# EAGLE design R201X (EAGLE 6.6.0)
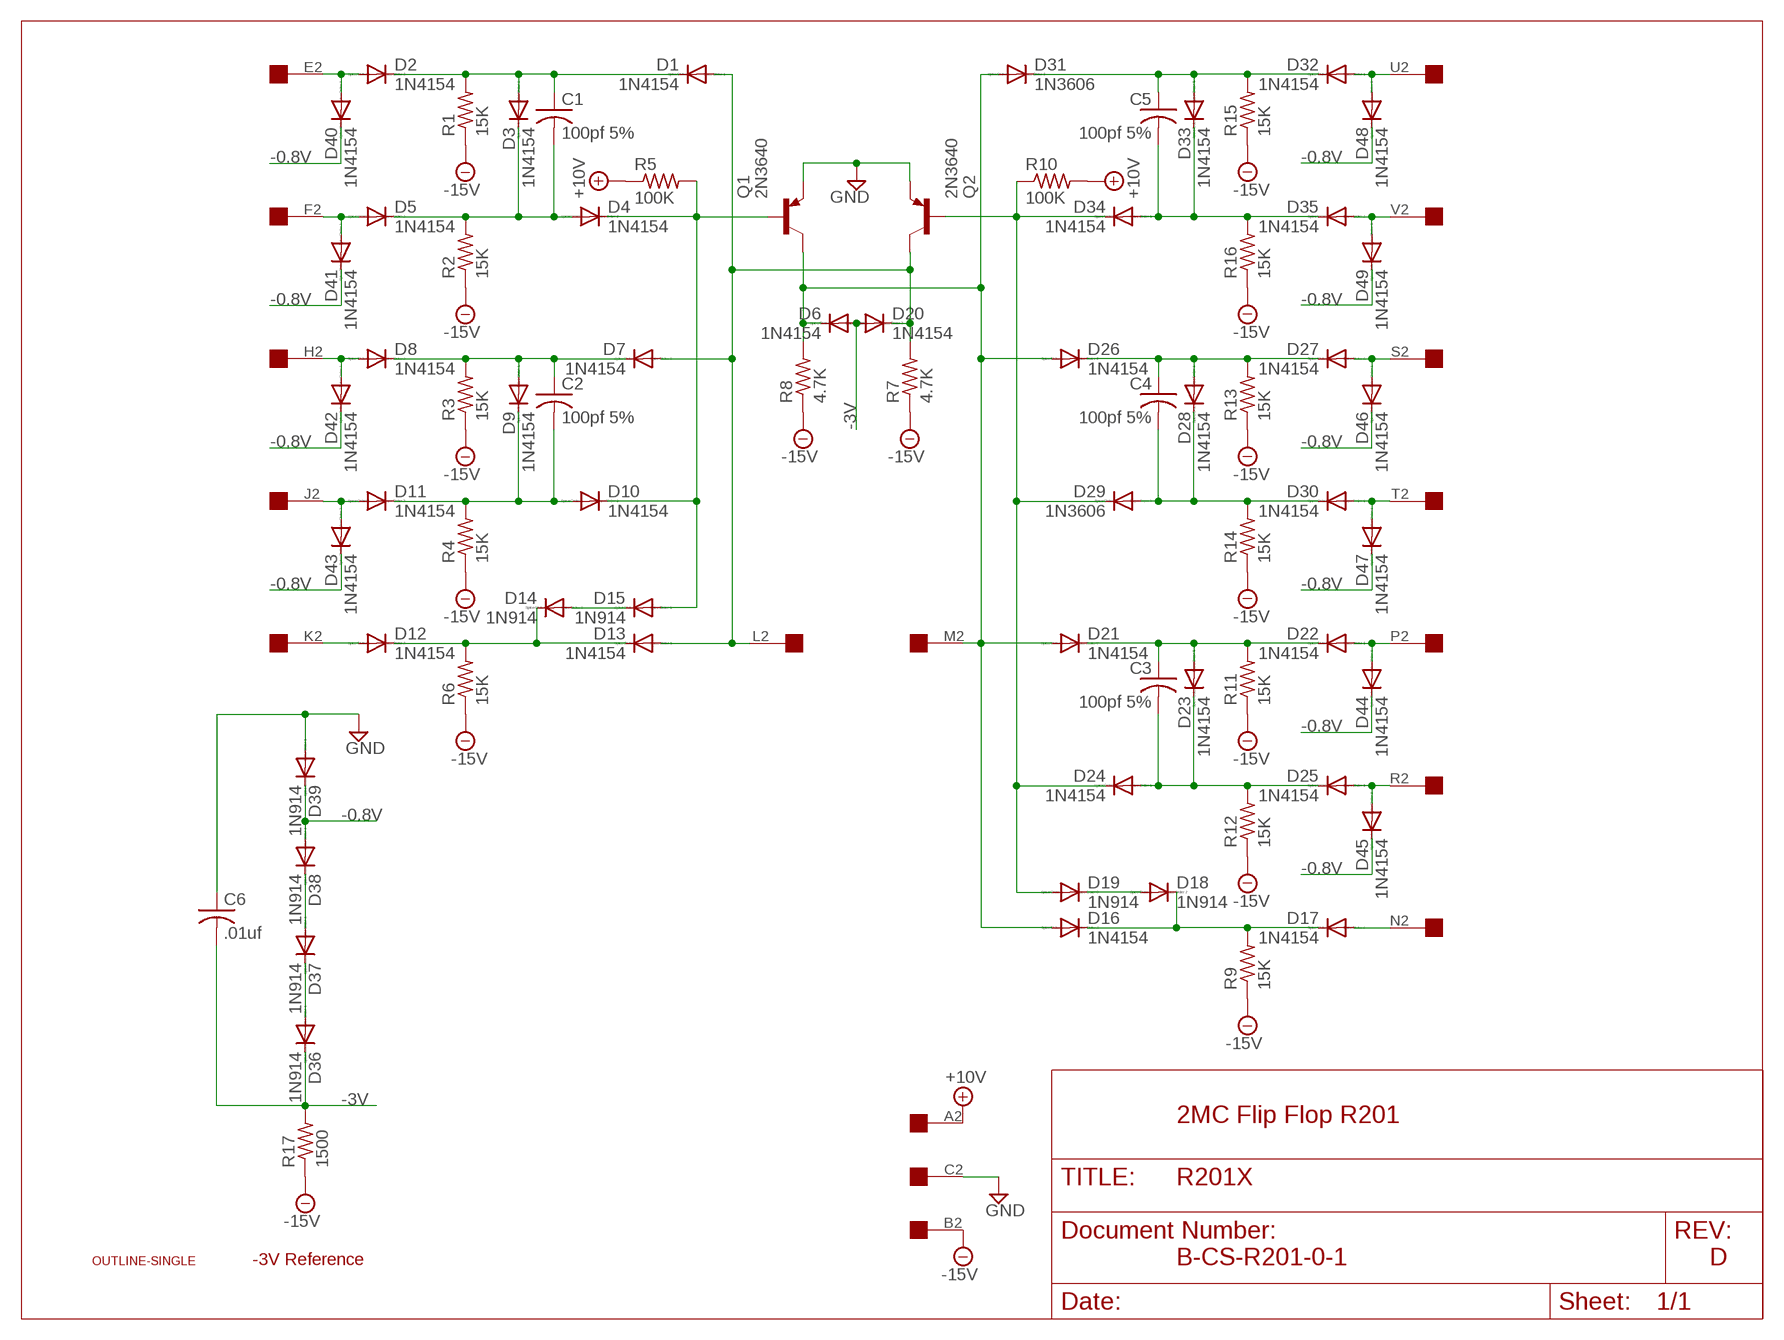
[diagram p0: schematic, sheet 1]

## Parts
C1  100pf 5%  C-US050-025X075  [C050-025X075]
C2  100pf 5%  C-US050-025X075  [C050-025X075]
C3  100pf 5%  C-US050-025X075  [C050-025X075]
C4  100pf 5%  C-US050-025X075  [C050-025X075]
C5  100pf 5%  C-US050-025X075  [C050-025X075]
C6  .01uf  C-US050-025X075  [C050-025X075]
D1  1N4154  1N4148DO35-10  [DO35-10]
D2  1N4154  1N4148DO35-10  [DO35-10]
D3  1N4154  1N4148DO35-10  [DO35-10]
D4  1N4154  1N4148DO35-10  [DO35-10]
D5  1N4154  1N4148DO35-10  [DO35-10]
D6  1N4154  1N4148DO35-10  [DO35-10]
D7  1N4154  1N4148DO35-10  [DO35-10]
D8  1N4154  1N4148DO35-10  [DO35-10]
D9  1N4154  1N4148DO35-10  [DO35-10]
D10  1N4154  1N4148DO35-10  [DO35-10]
D11  1N4154  1N4148DO35-10  [DO35-10]
D12  1N4154  1N4148DO35-10  [DO35-10]
D13  1N4154  1N4148DO35-10  [DO35-10]
D14  1N914  1N4148DO35-10  [DO35-10]
D15  1N914  1N4148DO35-10  [DO35-10]
D16  1N4154  1N4148DO35-10  [DO35-10]
D17  1N4154  1N4148DO35-10  [DO35-10]
D18  1N914  1N4148DO35-10  [DO35-10]
D19  1N914  1N4148DO35-10  [DO35-10]
D20  1N4154  1N4148DO35-10  [DO35-10]
D21  1N4154  1N4148DO35-10  [DO35-10]
D22  1N4154  1N4148DO35-10  [DO35-10]
D23  1N4154  1N4148DO35-10  [DO35-10]
D24  1N4154  1N4148DO35-10  [DO35-10]
D25  1N4154  1N4148DO35-10  [DO35-10]
D26  1N4154  1N4148DO35-10  [DO35-10]
D27  1N4154  1N4148DO35-10  [DO35-10]
D28  1N4154  1N4148DO35-10  [DO35-10]
D29  1N3606  1N4148DO35-10  [DO35-10]
D30  1N4154  1N4148DO35-10  [DO35-10]
D31  1N3606  1N4148DO35-10  [DO35-10]
D32  1N4154  1N4148DO35-10  [DO35-10]
D33  1N4154  1N4148DO35-10  [DO35-10]
D34  1N4154  1N4148DO35-10  [DO35-10]
D35  1N4154  1N4148DO35-10  [DO35-10]
D36  1N914  1N4148DO35-10  [DO35-10]
D37  1N914  1N4148DO35-10  [DO35-10]
D38  1N914  1N4148DO35-10  [DO35-10]
D39  1N914  1N4148DO35-10  [DO35-10]
D40  1N4154  1N4148DO35-10  [DO35-10]
D41  1N4154  1N4148DO35-10  [DO35-10]
D42  1N4154  1N4148DO35-10  [DO35-10]
D43  1N4154  1N4148DO35-10  [DO35-10]
D44  1N4154  1N4148DO35-10  [DO35-10]
D45  1N4154  1N4148DO35-10  [DO35-10]
D46  1N4154  1N4148DO35-10  [DO35-10]
D47  1N4154  1N4148DO35-10  [DO35-10]
D48  1N4154  1N4148DO35-10  [DO35-10]
D49  1N4154  1N4148DO35-10  [DO35-10]
Q1  2N3640  2N3637  [TO39]
Q2  2N3640  2N3637  [TO39]
R1  15K  R-US_0207/10  [0207/10]
R2  15K  R-US_0207/10  [0207/10]
R3  15K  R-US_0207/10  [0207/10]
R4  15K  R-US_0207/10  [0207/10]
R5  100K  R-US_0207/10  [0207/10]
R6  15K  R-US_0207/10  [0207/10]
R7  4.7K  R-US_0207/10  [0207/10]
R8  4.7K  R-US_0207/10  [0207/10]
R9  15K  R-US_0207/10  [0207/10]
R10  100K  R-US_0207/10  [0207/10]
R11  15K  R-US_0207/10  [0207/10]
R12  15K  R-US_0207/10  [0207/10]
R13  15K  R-US_0207/10  [0207/10]
R14  15K  R-US_0207/10  [0207/10]
R15  15K  R-US_0207/10  [0207/10]
R16  15K  R-US_0207/10  [0207/10]
R17  1500  R-US_0207/10  [0207/10]
U$1  OUTLINE-SINGLE  [SINGLE]
U$2  EDGE-1  [EDGE-CON1]

## Nets
+10V [Power]: R5.1 R10.2 U$2.A2
-0.8V [Power]: D38.A D39.C D40.C D41.C D42.C D43.C D44.C D45.C D46.C D47.C D48.C D49.C
-3V [Power]: C6.2 D6.A D20.A D36.C R17.2
-15V [Power]: R1.1 R2.1 R3.1 R4.1 R6.1 R7.1 R8.1 R9.1 R11.1 R12.1 R13.1 R14.1 R15.1 R16.1 R17.1 U$2.B2
GND [Power]: C6.1 D39.A Q1.1(E) Q2.1(E) U$2.C2
L: D1.A D7.A D13.A D20.C Q2.3(C) R7.2 U$2.L2
M: D6.C D16.A D21.A D26.A D31.A Q1.3(C) R8.2 U$2.M2
N$1: D5.A D41.A U$2.F2
N$2: C5.1 D31.C D32.C D33.A R15.2
N$3: C1.2 D3.C D4.A D5.C R2.2
N$4: C1.1 D1.C D2.C D3.A R1.2
N$5: D12.A U$2.K2
N$6: D19.A D24.C D29.C D34.C Q2.2(B) R10.1
N$7: D32.A D48.A U$2.U2
N$8: C5.2 D33.C D34.A D35.C R16.2
N$9: D17.A U$2.N2
N$10: D2.A D40.A U$2.E2
N$11: D35.A D49.A U$2.V2
N$12: D18.A D19.C
N$13: D37.A D38.C
N$14: D4.C D10.C D15.A Q1.2(B) R5.2
N$15: D14.A D15.C
N$16: D36.A D37.C
N$17: D22.A D44.A U$2.P2
N$18: D12.C D13.C D14.C R6.2
N$19: D8.A D42.A U$2.H2
N$20: D16.C D17.C D18.C R9.2
N$21: D11.A D43.A U$2.J2
N$22: C2.2 D9.C D10.A D11.C R4.2
N$23: D27.A D46.A U$2.S2
N$24: C2.1 D7.C D8.C D9.A R3.2
N$25: D30.A D47.A U$2.T2
N$26: C4.2 D28.C D29.A D30.C R14.2
N$27: C4.1 D26.C D27.C D28.A R13.2
N$28: D25.A D45.A U$2.R2
N$29: C3.2 D23.C D24.A D25.C R12.2
N$30: C3.1 D21.C D22.C D23.A R11.2
Unconnected: U$2.D2

## Notes on the sheet
- 2MC Flip Flop R201
- -3V Reference | B-CS-R201-0-1 | D

## Library data of the parts
C1-C6 = rcl:C-US: CAPACITOR, American symbol
D1-D49 = diode:1N4148: DIODE high speed (Philips)
Q1 Q2 = transistor-pnp:2N3637*: PNP Transistror
R1-R17 = rcl:R-US_: RESISTOR, American symbol
U$1 = dec-con:OUTLINE-*: Board outlines for DEC boards.
U$2 = dec-con:EDGE-1: Single-Sided DEC Edge Connector -- (side 2)

## Net classes
1 Power: width 0.813 mm

## Board
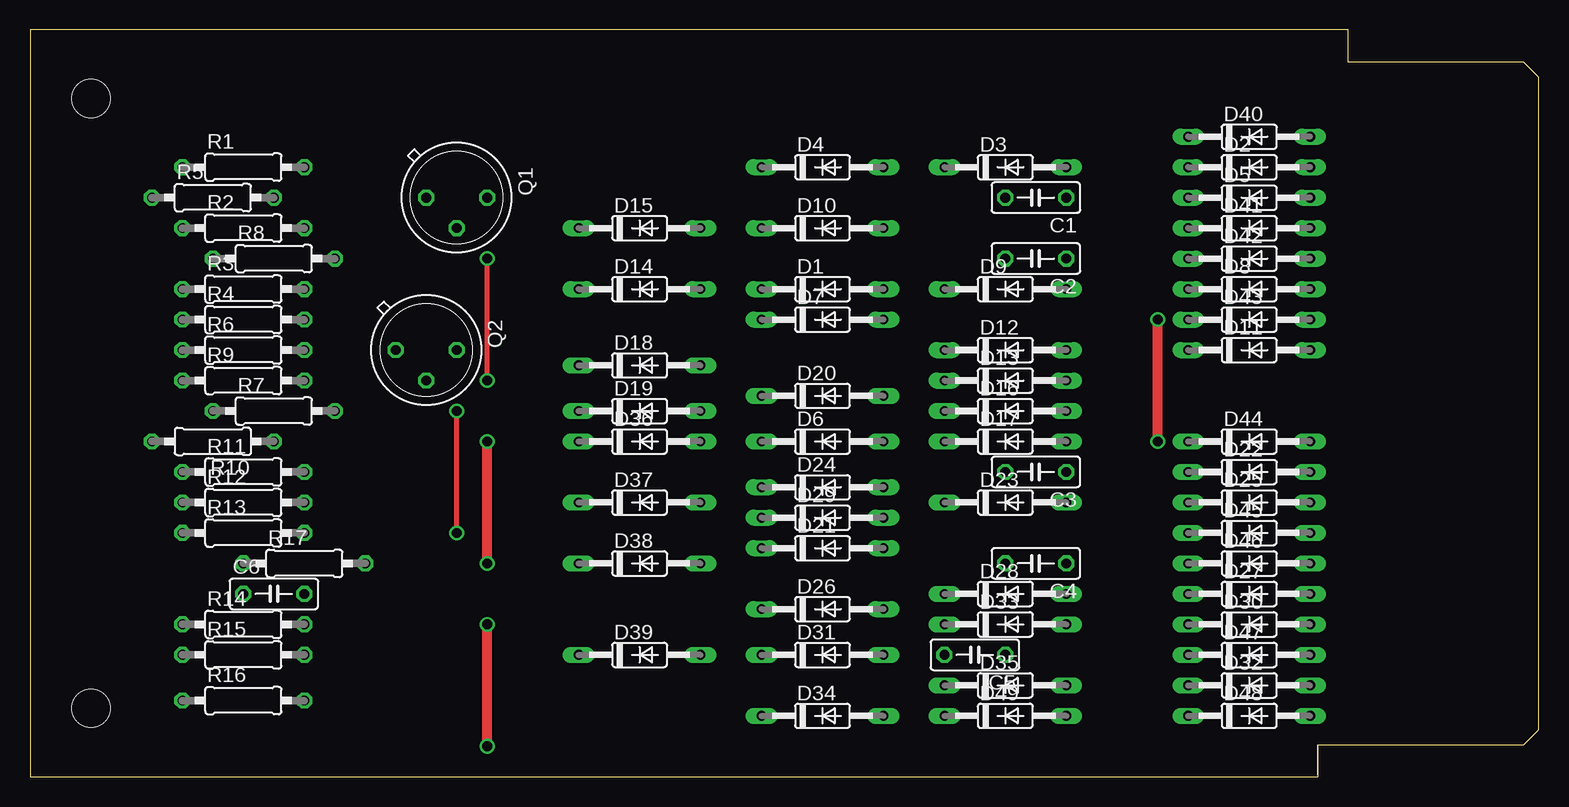
[diagram p1: board, top side]
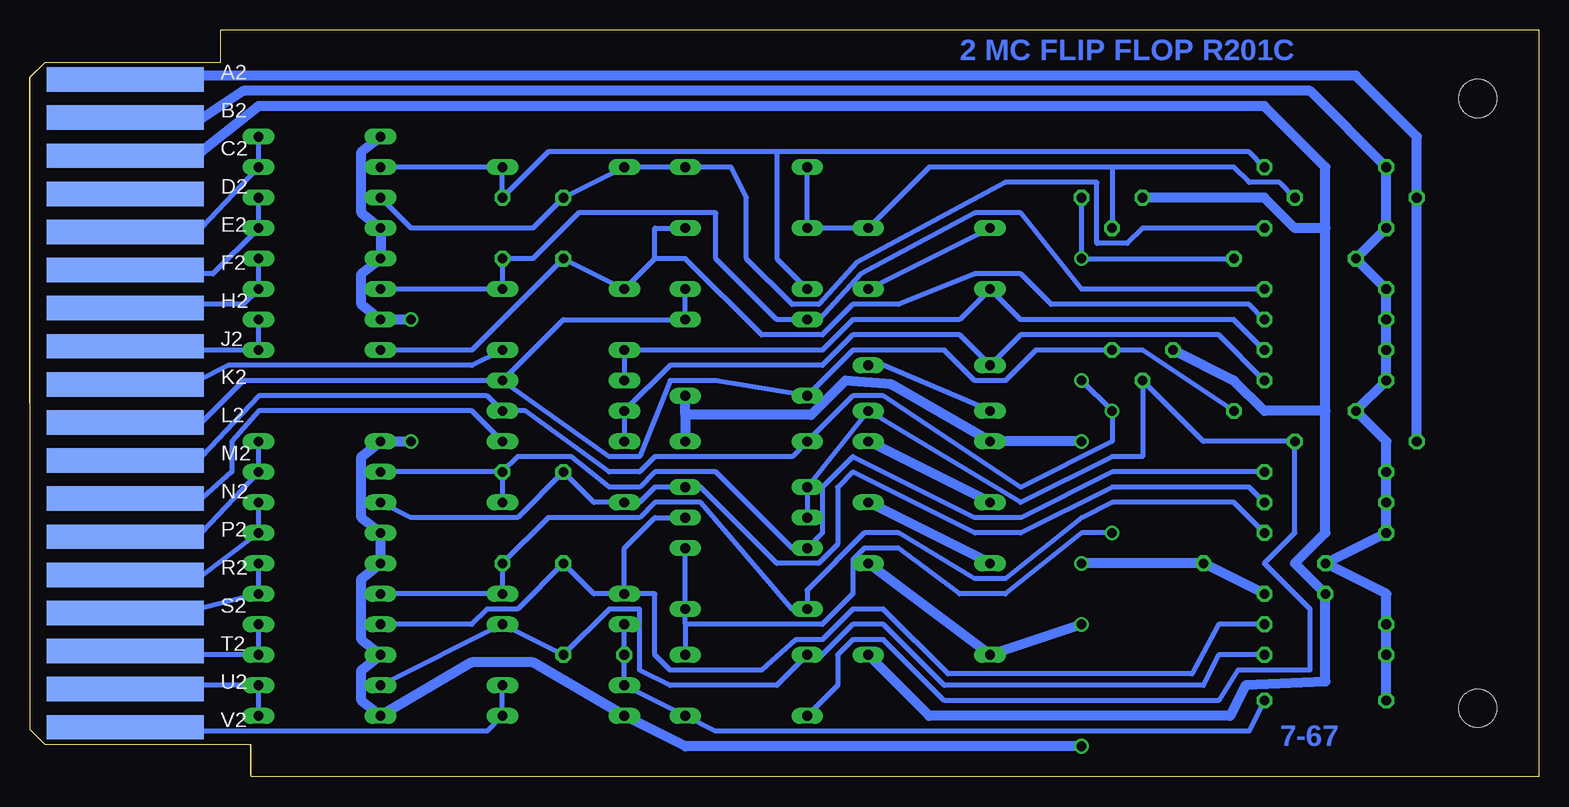
[diagram p2: board, bottom side, seen from below]

Size 125.73 x 62.23 mm. Coordinates in mm from the lower left corner, seen from the top.
Copper layers (1+16): Top 0.035mm / dielectric 1.5mm / Bottom 0.035mm
Design rules "16mils": minimum track width 16mil, minimum drill 32mil, track to track 15mil, track to pad 10mil, pad to pad 10mil, via to via 10mil, smd to smd 10mil, copper to edge 13mil, drill to drill 10mil, minimum pad ring 10mil, minimum via ring 8mil, stop-mask expansion 0mil, vias tented up to drill 0mil, thermal gap 10mil

### Footprints (pad centres in the part's own frame; a part is rotated, then mirrored left to right if it is on the bottom)
C050-025X075 = drill 0.813 octagon: 1 -2.54,0; 2 2.54,0
DO35-10 = drill 0.813 long: A 5.08,0; C -5.08,0
TO39 = drill 0.813 octagon: 1 0,-2.54; 2 2.54,0; 3 0,2.54
0207/10 = drill 0.813 octagon: 1 -5.08,0; 2 5.08,0
SINGLE = hole 3.175: 120.65,56.515; 120.65,5.715
EDGE-CON1 = smd 13.106 x 2.032 bottom: A2 7.938,4.128; B2 7.938,7.303; C2 7.938,10.477; D2 7.938,13.652; E2 7.938,16.828; F2 7.938,20.003; H2 7.938,23.177; J2 7.938,26.352; K2 7.938,29.527; L2 7.938,32.703; M2 7.938,35.877; N2 7.938,39.053; P2 7.938,42.227; R2 7.938,45.403; S2 7.938,48.578; T2 7.938,51.752; U2 7.938,54.928; V2 7.938,58.102

### Placement (x,y rotation side)
C1  83.82,48.26 180 top
C2  83.82,43.18 180 top
C3  83.82,25.4 180 top
C4  83.82,17.78 180 top
C5  78.74,10.16 180 top
C6  20.32,15.24 0 top
D1  66.04,40.64 0 top
D2  101.6,50.8 0 top
D3  81.28,50.8 0 top
D4  66.04,50.8 0 top
D5  101.6,48.26 0 top
D6  66.04,27.94 0 top
D7  66.04,38.1 0 top
D8  101.6,40.64 0 top
D9  81.28,40.64 0 top
D10  66.04,45.72 0 top
D11  101.6,35.56 0 top
D12  81.28,35.56 0 top
D13  81.28,33.02 0 top
D14  50.8,40.64 0 top
D15  50.8,45.72 0 top
D16  81.28,30.48 0 top
D17  81.28,27.94 0 top
D18  50.8,34.29 0 top
D19  50.8,30.48 0 top
D20  66.04,31.75 0 top
D21  66.04,19.05 0 top
D22  101.6,25.4 0 top
D23  81.28,22.86 0 top
D24  66.04,24.13 0 top
D25  101.6,22.86 0 top
D26  66.04,13.97 0 top
D27  101.6,15.24 0 top
D28  81.28,15.24 0 top
D29  66.04,21.59 0 top
D30  101.6,12.7 0 top
D31  66.04,10.16 0 top
D32  101.6,7.62 0 top
D33  81.28,12.7 0 top
D34  66.04,5.08 0 top
D35  81.28,7.62 0 top
D36  50.8,27.94 0 top
D37  50.8,22.86 0 top
D38  50.8,17.78 0 top
D39  50.8,10.16 0 top
D40  101.6,53.34 0 top
D41  101.6,45.72 0 top
D42  101.6,43.18 0 top
D43  101.6,38.1 0 top
D44  101.6,27.94 0 top
D45  101.6,20.32 0 top
D46  101.6,17.78 0 top
D47  101.6,10.16 0 top
D48  101.6,5.08 0 top
D49  81.28,5.08 0 top
Q1  35.56,48.26 270 top
Q2  33.02,35.56 270 top
R1  17.78,50.8 0 top
R2  17.78,45.72 0 top
R3  17.78,40.64 0 top
R4  17.78,38.1 0 top
R5  15.24,48.26 0 top
R6  17.78,35.56 0 top
R7  20.32,30.48 0 top
R8  20.32,43.18 0 top
R9  17.78,33.02 0 top
R10  15.24,27.94 180 top
R11  17.78,25.4 0 top
R12  17.78,22.86 0 top
R13  17.78,20.32 0 top
R14  17.78,12.7 0 top
R15  17.78,10.16 0 top
R16  17.78,6.35 0 top
R17  22.86,17.78 0 top
U$1  125.73,62.23 180 top
U$2  125.73,62.23 180 top

### Tracks (layer width: path | path; a pad name or v marks a point on that pad's centre or on a via)
+10V
  Bottom 0.813: R10.2 R5.1 10.16,53.34 15.24,58.42 111.76,58.42 U$2.A2
-0.8V  (via drill 0.81)
  Top 0.813: v93.98,27.94 v93.98,38.1 | v38.1,2.54 v38.1,12.7
  Bottom 0.813: D40.C 98.11,52.07 98.11,46.99 D41.C D42.C 98.11,41.91 98.11,39.37 D43.C v93.98,38.1 | v93.98,27.94 D44.C 98.11,26.67 98.11,21.59 D45.C D46.C 98.11,16.51 98.11,11.43 D47.C 98.11,8.89 98.11,6.35 D48.C 88.9,9.53 83.82,9.53 D49.C 71.12,2.54 v38.1,2.54 | v38.1,12.7 D39.C D38.A
-3V  (via drill 0.81)
  Top 0.813: v38.1,17.78 v38.1,27.94
  Bottom 0.813: v38.1,27.94 D36.C 53.98,32.7 57.78,33.02 60.64,30.16 71.12,30.16 | v38.1,17.78 R17.2 C6.2 | 71.12,30.16 D6.A | 71.12,30.16 D20.A
-15V
  Bottom 0.813: R16.1 R15.1 R14.1 12.7,15.24 R17.1 R13.1 R12.1 R11.1 12.7,27.94 R7.1 R9.1 R6.1 R4.1 R3.1 R8.1 R2.1 R1.1 19.05,57.15 107.95,57.15 111.76,54.61 U$2.B2
GND
  Bottom 0.813: U$2.C2 111.44,52.07 106.68,55.88 22.86,55.88 17.78,50.8 17.78,45.72 | 17.78,30.48 17.78,20.32 20.32,17.78 C6.1 17.78,7.94 24.45,7.62 25.72,5.08 50.8,5.08 D39.A | 17.78,30.48 17.78,45.72 | Q1.1 22.86,48.26 20.32,45.72 17.78,45.72 | Q2.1 25.4,33.02 22.86,30.48 17.78,30.48
L
  Bottom 0.406: U$2.L2 111.76,29.21 107.95,33.02 D13.A | D1.A D7.A 81.28,38.1 D13.A | D13.A 77.47,26.67 74.93,26.67 72.39,33.02 68.58,33.02 D20.C 57.15,35.56 49.53,35.56 46.99,33.02 44.45,33.02 41.91,35.56 Q2.3 33.02,35.56 R7.2
M  (via drill 0.81)
  Top 0.406: v38.1,33.02 v38.1,43.18 | v35.56,20.32 v35.56,30.48
  Bottom 0.406: U$2.M2 111.44,26.67 106.68,31.75 87.63,31.75 D16.A 84.45,30.48 77.47,25.4 74.93,25.4 73.66,26.67 62.23,26.67 D6.C 57.15,31.75 54.61,31.75 43.18,24.13 35.56,27.94 v35.56,30.48 v38.1,33.02 | D21.A D26.A 71.12,12.7 | 71.12,12.7 D31.A | R8.2 v38.1,43.18 Q1.3 | 71.12,12.7 59.69,12.7 57.15,15.24 57.15,18.1 56.2,19.05 53.34,19.05 48.26,15.24 44.45,15.24 38.1,20.32 v35.56,20.32
N$1
  Bottom 0.406: U$2.F2 112.04,42.19 111.76,41.91 110.49,41.91 D41.A D5.A
N$2
  Bottom 0.406: D32.C D33.A C5.1 77.47,13.97 74.93,13.97 74.93,8.89 72.39,7.62 63.5,7.62 D31.C 59.69,10.16 57.15,12.7 54.61,12.7 49.53,7.62 27.94,7.62 26.67,10.16 R15.2
N$3
  Bottom 0.406: D5.C 93.98,45.72 83.82,45.72 C1.2 D3.C D4.A 67.31,50.8 66.04,48.26 66.04,43.18 62.23,39.37 60.01,39.37 56.83,42.86 44.45,49.53 36.83,49.53 36.83,44.45 34.29,44.45 33.02,45.72 R2.2
N$4
  Bottom 0.406: D2.C D3.A C1.1 82.55,52.07 63.5,52.07 | 63.5,52.07 63.5,43.18 D1.C | R1.2 24.13,52.07 63.5,52.07
N$5
  Bottom 0.406: U$2.K2 111.76,33.02 109.22,34.29 88.9,34.29 D12.A
N$6
  Bottom 0.406: D29.C D24.C D19.A 43.18,22.86 35.56,26.67 33.02,26.67 Q2.2 27.94,27.94 R10.1 20.32,20.32 22.86,17.78 19.05,13.97 19.05,8.89 25.08,8.89 26.67,6.35 49.53,6.35 54.61,11.43 57.15,11.43 58.42,10.16 58.42,7.62 D34.C
N$7
  Bottom 0.406: U$2.U2 111.76,7.62 D32.A D48.A
N$8
  Bottom 0.406: D33.C C5.2 D35.C D34.A 68.58,3.81 24.13,3.81 R16.2
N$9
  Bottom 0.406: U$2.N2 111.76,22.86 108.9,25.4 108.9,27.94 106.68,30.48 88.9,30.48 D17.A
N$10
  Bottom 0.406: U$2.E2 111.76,45.39 111.44,45.72 D2.A D40.A
N$11
  Bottom 0.406: U$2.V2 112.08,4.13 111.76,3.81 87.63,3.81 D49.A D35.A
N$12
  Bottom 0.406: D19.C 54.61,34.29 D18.A
N$13
  Bottom 0.813: D38.C D37.A
N$14
  Bottom 0.406: R5.2 21.59,49.53 24.13,49.53 25.4,50.8 35.56,50.8 | 35.56,50.8 Q1.2 | D4.C D10.C D15.A 50.8,50.8 35.56,50.8
N$15
  Bottom 0.406: D15.C D14.A
N$16
  Bottom 0.813: D37.C D36.A
N$17
  Bottom 0.406: U$2.P2 111.44,20.32 D22.A D44.A
N$18
  Bottom 0.406: D13.C D12.C 59.69,35.56 57.15,38.1 48.26,38.1 D14.C 43.18,38.1 25.4,38.1 R6.2
N$19
  Bottom 0.406: U$2.H2 112.09,39.04 111.76,39.37 107.95,39.37 D8.A D42.A
N$20
  Bottom 0.406: D17.C D16.C 72.39,34.29 59.69,34.29 57.15,36.83 48.26,36.83 D18.C 43.18,36.83 26.67,36.83 R9.2
N$21
  Bottom 0.406: U$2.J2 112.09,35.89 111.76,35.56 D11.A D43.A
N$22
  Bottom 0.406: D11.C 88.9,35.56 C2.2 D9.C 73.66,43.18 | 73.66,43.18 73.66,45.72 D10.A | R4.2 24.13,39.37 40.64,39.37 43.18,41.91 46.99,41.91 53.34,39.37 57.15,39.37 59.69,36.83 64.77,36.83 71.12,43.18 73.66,43.18
N$23
  Bottom 0.406: U$2.S2 111.76,13.97 D27.A D46.A
N$24
  Bottom 0.406: D8.C D9.A C2.1 83.82,43.18 80.01,46.99 68.58,46.99 68.58,43.18 63.5,38.1 D7.C 60.01,38.1 56.52,41.91 46.99,46.99 43.18,46.99 38.1,40.64 R3.2
N$25
  Bottom 0.406: U$2.T2 111.76,10.16 D47.A D30.A
N$26
  Bottom 0.406: D30.C 88.9,12.7 87.63,13.97 85.09,13.97 C4.2 78.74,15.24 D28.C | D28.C 73.66,15.24 73.66,10.16 72.39,8.89 64.77,8.89 61.91,11.43 59.69,11.43 57.15,13.97 54.61,13.97 49.21,8.57 28.89,8.57 26.67,12.7 R14.2 | D28.C 76.2,19.05 73.66,21.59 D29.A
N$27
  Bottom 0.406: D27.C D28.A C4.1 82.55,21.59 74.93,21.59 73.66,22.86 69.85,22.86 62.23,13.97 D26.C 60.96,15.56 56.2,20.32 53.34,20.32 46.99,16.51 44.45,16.51 38.1,21.59 35.56,22.86 25.4,22.86 R13.2
N$28
  Bottom 0.406: U$2.R2 111.76,16.51 D45.A D25.A
N$29
  Bottom 0.406: D25.C 93.98,21.59 85.09,21.59 C3.2 78.74,22.86 D23.C 74.93,22.86 73.66,24.13 D24.A 69.85,24.13 63.5,17.78 60.01,17.78 58.42,19.37 58.42,24.13 57.15,25.4 46.99,20.32 43.18,20.32 35.56,24.13 24.13,24.13 R12.2
N$30
  Bottom 0.406: C3.1 D22.C | C3.1 D23.A | R11.2 35.56,25.4 43.18,21.59 46.99,21.59 57.15,26.67 59.69,24.13 59.69,20.32 D21.C 62.23,19.05 68.58,25.4 73.66,25.4 74.93,24.13 77.47,24.13 80.64,26.67 85.09,26.67 C3.1

### Text on the board
Bottom: 2 MC FLIP FLOP R201C | 7-67